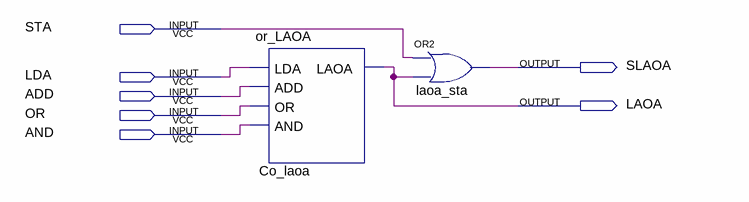
[diagram p0: schematic sheet]
// Quartus schematic or_SLAOA.bdf as structural Verilog: 2 symbols, 7 pins
module or_SLAOA (
  input  STA,
  input  LDA,
  input  ADD,
  input  OR,
  input  AND,
  output SLAOA,
  output LAOA
);

  or_LAOA Co_laoa (.LDA(LDA), .ADD(ADD), .OR(OR), .AND(AND), .LAOA(LAOA));
  or laoa_sta (SLAOA, STA, LAOA);
endmodule
